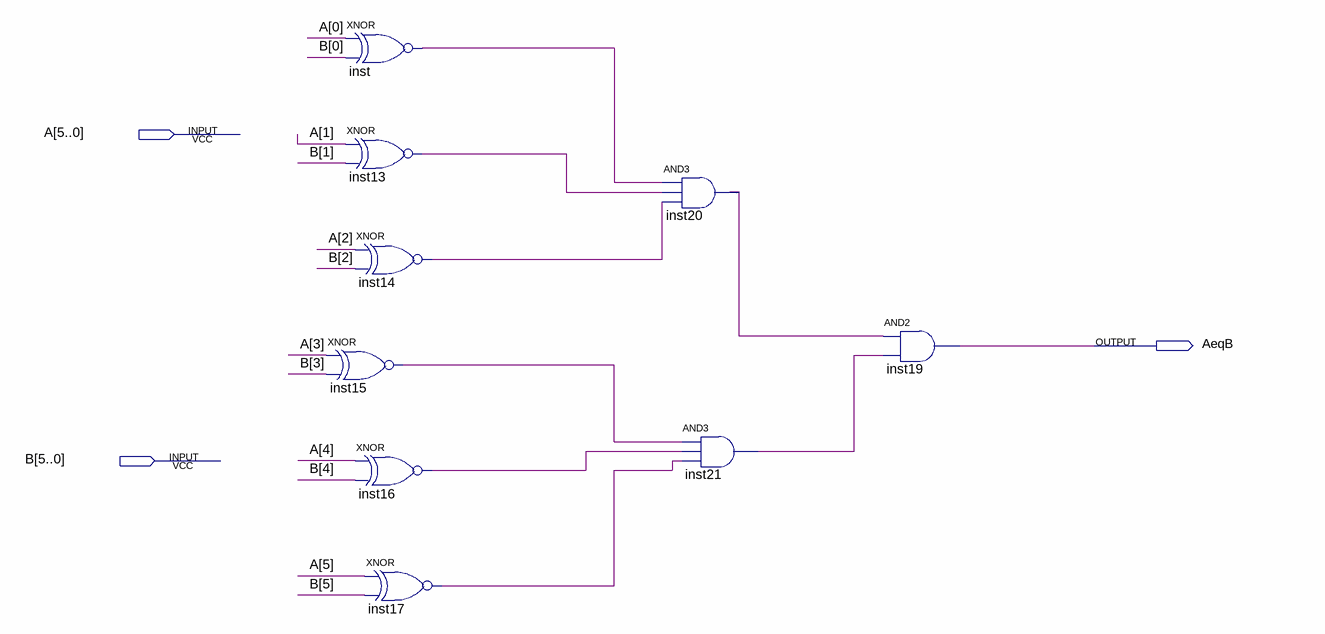
[diagram p0: schematic sheet]
// Quartus schematic g47_comp6.bdf as structural Verilog: 9 symbols, 3 pins
module g47_comp6 (
  input  [5:0] A,
  input  [5:0] B,
  output AeqB
);

  wire inst13_out, inst14_out, inst15_out, inst16_out, inst17_out, inst20_out, inst21_out, inst_out;

  xnor inst (inst_out, A[0], B[0]);
  xnor inst13 (inst13_out, A[1], B[1]);
  xnor inst14 (inst14_out, A[2], B[2]);
  xnor inst15 (inst15_out, A[3], B[3]);
  xnor inst16 (inst16_out, A[4], B[4]);
  xnor inst17 (inst17_out, A[5], B[5]);
  and inst20 (inst20_out, inst_out, inst13_out, inst14_out);
  and inst21 (inst21_out, inst15_out, inst16_out, inst17_out);
  and inst19 (AeqB, inst20_out, inst21_out);
endmodule
